# Altium schematic sheet Video out.SchDoc
size A4; SheetNumber: 13; SheetTotal: 15
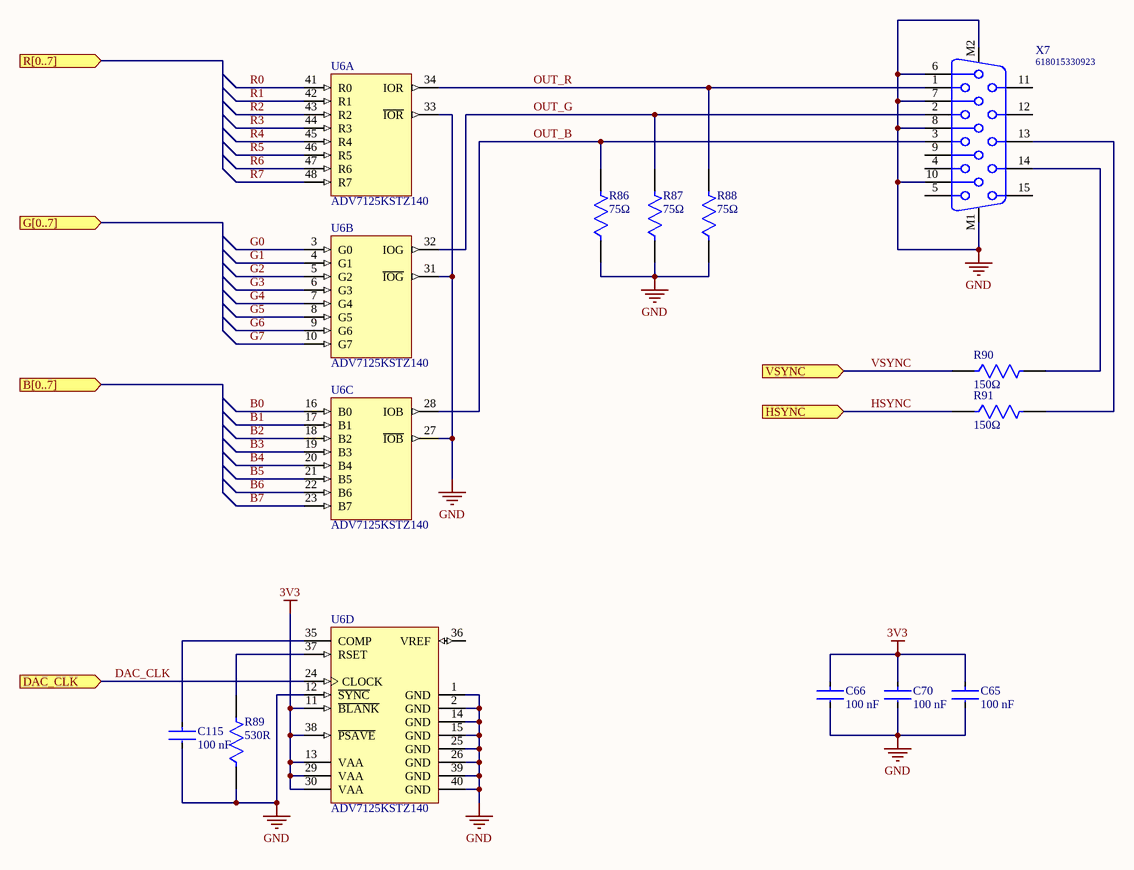
[diagram p0: Video out.SchDoc]

## Parts
C65  Capacitance: 100 nF  [FP-CC0805-0_85-IPC_A]  (hidden comment: CC0805KRX7R9BB104)
C66  Capacitance: 100 nF  [FP-CC0805-0_85-IPC_A]  (hidden comment: CC0805KRX7R9BB104)
C70  Capacitance: 100 nF  [FP-CC0805-0_85-IPC_A]  (hidden comment: CC0805KRX7R9BB104)
C115  Capacitance: 100 nF  [FP-CC0805-0_85-IPC_A]  (hidden comment: CC0805KRX7R9BB104)
R86  Resistance: 75Ω  [FP-RN732A-IPC_A]  (hidden comment: RN73C2A75RBTDF)
R87  Resistance: 75Ω  [FP-RN732A-IPC_A]  (hidden comment: RN73C2A75RBTDF)
R88  Resistance: 75Ω  [FP-RN732A-IPC_A]  (hidden comment: RN73C2A75RBTDF)
R89  Resistance: 530R  [FP-CRCW0805-HPe3-IPC_A]  (hidden comment: TNPW0805530RBETA)
R90  Resistance: 150Ω  [FP-RN732A-IPC_A]  (hidden comment: RN73C2A150RBTDF)
R91  Resistance: 150Ω  [FP-RN732A-IPC_A]  (hidden comment: RN73C2A150RBTDF)
U6  ADV7125KSTZ140  [ST-48_N]  (parts A,B,C,D of 4)
X7  618015330923  [618015330923]

## Ports
B[0..7] (in), DAC_CLK (in), G[0..7] (in), HSYNC (in), R[0..7] (in), VSYNC (in)

## Nets
3V3: C65.1 C66.1 C70.1 U6.11(~{BLANK}) U6.13(VAA) U6.29(VAA) U6.30(VAA) U6.38(~{PSAVE})
GND: C65.2 C66.2 C70.2 C115.2 R86.1 R87.1 R88.1 R89.1 U6.1(GND) U6.2(GND) U6.12(~{SYNC}) U6.14(GND) U6.15(GND) U6.25(GND) U6.26(GND) U6.27(~{IOB}) U6.31(~{IOG}) U6.33(~{IOR}) U6.39(GND) U6.40(GND) X7.6 X7.7 X7.8 X7.10 X7.M1 X7.M2
B0: U6.16(B0)
B1: U6.17(B1)
B2: U6.18(B2)
B3: U6.19(B3)
B4: U6.20(B4)
B5: U6.21(B5)
B6: U6.22(B6)
B7: U6.23(B7)
DAC_CLK: U6.24(CLOCK) ; port DAC_CLK
G0: U6.3(G0)
G1: U6.4(G1)
G2: U6.5(G2)
G3: U6.6(G3)
G4: U6.7(G4)
G5: U6.8(G5)
G6: U6.9(G6)
G7: U6.10(G7)
HSYNC: R91.1 ; port HSYNC
OUT_B: R86.2 U6.28(IOB) X7.3
OUT_G: R87.2 U6.32(IOG) X7.2
OUT_R: R88.2 U6.34(IOR) X7.1
R0: U6.41(R0)
R1: U6.42(R1)
R2: U6.43(R2)
R3: U6.44(R3)
R4: U6.45(R4)
R5: U6.46(R5)
R6: U6.47(R6)
R7: U6.48(R7)
VSYNC: R90.1 ; port VSYNC
NetC115_1: C115.1 U6.35(COMP)
NetR89_2: R89.2 U6.37(RSET)
NetR90_2: R90.2 X7.14
NetR91_2: R91.2 X7.13

Not connected (* = marked no-connect by the designer): U6 36(VREF); X7 4 5 9 11 12 15

## Library data of the parts
C65 C66 C70 C115 = CMP-2100-03606-3: CAP CER 0.1UF 50V X7R 0805; Manufacturer: Yageo; Value: 100 nF; Manufacturer Part Number: CC0805KRX7R9BB104; Category: Cap; Case/Package: 0805
R86-R88 = CMP-03211-006560-1: SMD Chip Resistor, Thin Film, 75Ω, 100 V, 0805 [2012 Metric], 100 mW, 0.1%, RN73 Series; Manufacturer: TE Connectivity; Value: 75Ω; Category: Res; Manufacturer Part Number: RN73C2A75RBTDF; Case/Package: 0805
R89 = CMP-02407-005666-1: RES Thick Film, 560Ω, 1%, 0.5W, 100ppm/°C, 0805; Manufacturer: Vishay; Manufacturer Part Number: CRCW0805560RFKEAHP; value: 530Ω; Case/Package: 0805; Termination: Wraparound; Number of Terminations: 2; Category: Res
R90 R91 = CMP-03211-002331-1: SMD Chip Resistor, Thin Film, 150Ω, 100 V, 0805 [2012 Metric], 100 mW, 0.1%, RN73 Series; Manufacturer: TE Connectivity; Value: 150Ω; Manufacturer Part Number: RN73C2A150RBTDF; Category: Res; Case/Package: 0805
U6 = CMP-0318-00718-2: 3 Channel 8-Bit CMOS High Speed Video Digital-to-Analog Converter, -40 to +85 degC, ST-48, Pb-Free, Tray; Manufacturer: Analog Devices; PackageDescription: 48-Pin Thin Quad Flat Pack 0.5 mm Pitch; PartNumber: ADV7125KSTZ140; Manufacturer Part Number: ADV7125KSTZ140; value: ADV7125KSTZ140; Case/Package: TQFP-48; Category: IC
X7 = CMP-1502-00216-1: Female High Density PCB Connector with Hex Screw WR-DSUB, Angled, 15 pins; Manufacturer: Wurth Electronics; Manufacturer Part Number: 618015330923; value: DSUB, Angled, 15 pins; Case/Package: DSUB-15; Category: Connector